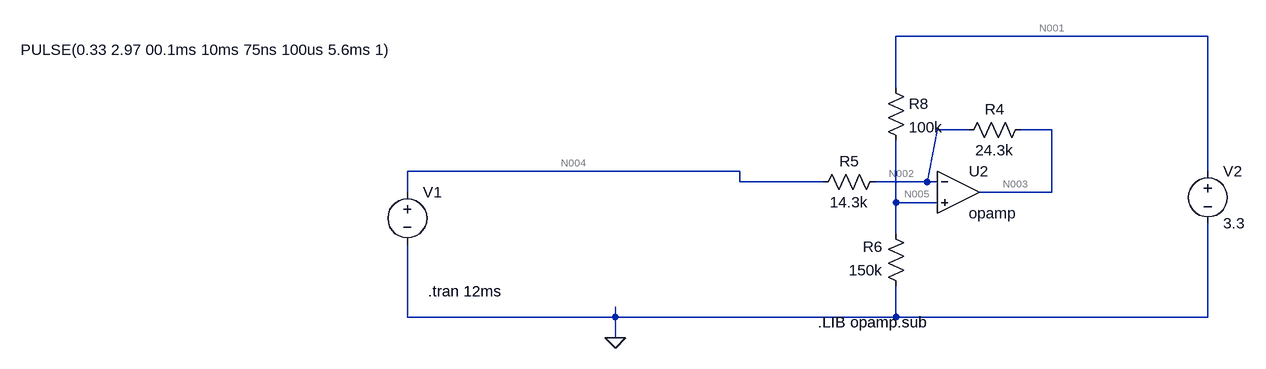
[diagram p0: schematic IWind_encoder.asc]
IWind_encoder.asc, the LTspice schematic file:
Version 4
SHEET 1 1040 680
WIRE 960 -64 480 -64
WIRE 480 16 480 -64
WIRE 592 80 544 80
WIRE 720 80 672 80
WIRE 240 144 -272 144
WIRE 960 144 960 -64
WIRE 240 160 240 144
WIRE 368 160 240 160
WIRE 528 160 544 80
WIRE 528 160 448 160
WIRE 544 160 528 160
WIRE -272 176 -272 144
WIRE 720 176 720 80
WIRE 720 176 608 176
WIRE 480 192 480 96
WIRE 544 192 480 192
WIRE 480 240 480 192
WIRE -272 368 -272 256
WIRE 48 368 48 352
WIRE 48 368 -272 368
WIRE 480 368 480 320
WIRE 480 368 48 368
WIRE 960 368 960 224
WIRE 960 368 480 368
WIRE 48 400 48 368
FLAG 48 400 0
SYMBOL voltage -272 160 R0
WINDOW 3 -595 -203 Left 2
WINDOW 123 0 0 Left 2
WINDOW 39 0 0 Left 2
SYMATTR Value PULSE(0.33 2.97 00.1ms 10ms 75ns 100us 5.6ms 1)
SYMATTR InstName V1
SYMBOL Opamps\\opamp 576 112 R0
SYMATTR InstName U2
SYMBOL res 688 64 R90
WINDOW 0 0 56 VBottom 2
WINDOW 3 32 56 VTop 2
SYMATTR InstName R4
SYMATTR Value 24.3k
SYMBOL res 464 144 R90
WINDOW 0 0 56 VBottom 2
WINDOW 3 32 56 VTop 2
SYMATTR InstName R5
SYMATTR Value 14.3k
SYMBOL res 496 336 R180
WINDOW 0 36 76 Left 2
WINDOW 3 36 40 Left 2
SYMATTR InstName R6
SYMATTR Value 150k
SYMBOL voltage 960 128 R0
WINDOW 123 0 0 Left 2
WINDOW 39 0 0 Left 2
SYMATTR InstName V2
SYMATTR Value 3.3
SYMBOL res 464 0 R0
SYMATTR InstName R8
SYMATTR Value 100k
TEXT 360 376 Left 2 !.LIB opamp.sub
TEXT -240 328 Left 2 !.tran 12ms

The netlist it stands for:
* IWind_encoder.asc
V1 N004 0 PULSE(0.33 2.97 00.1ms 10ms 75ns 100us 5.6ms 1)
XU2 N002 N005 N003 opamp Aol=100K GBW=10Meg  ; pins invin noninvin out
R4 N003 N002 24.3k
R5 N002 N004 14.3k
R6 0 N005 150k
V2 N001 0 3.3
R8 N001 N005 100k
.LIB opamp.sub
.tran 12ms
.backanno
.end

* Results of the author's LTspice run, read from the files saved beside the schematic
* Operating Point, zero values left out:
*   V(n004) = 330 mV
*   V(n003) = 4.784 V
*   V(n005) = 1.98 V
*   V(n002) = 1.98 V
*   V(n001) = 3.3 V
*   I(R8) = 13.2 µA
*   I(R6) = -13.2 µA
*   I(R5) = 115.4 µA
*   I(R4) = 115.4 µA
*   I(V2) = -13.2 µA
*   I(V1) = 115.4 µA
*   Ix(u2:3) = -115.4 µA
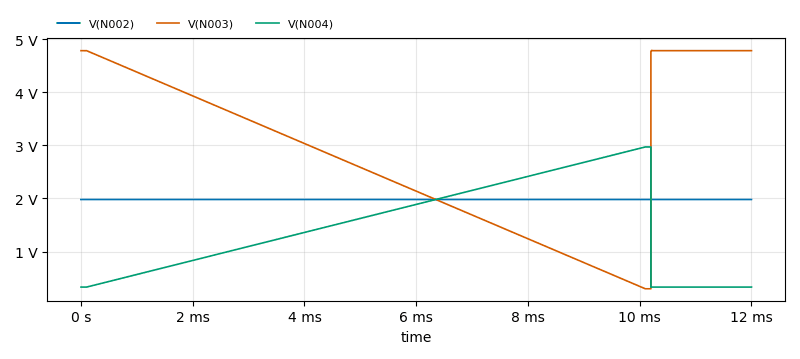
[diagram p1: Transient Analysis of IWind_encoder.asc, plotted from the saved traces]
* Transient Analysis, 1 run:
*   V(N002): min 1.192 V, max 1.982 V, average 1.98 V, rms 1.98 V, last 1.98 V
*   V(N003): min 297.7 mV, max 4.789 V, average 2.877 V, rms 3.273 V, last 4.784 V
*   V(N004): min 330 mV, max 2.97 V, average 1.452 V, rms 1.718 V, last 330 mV